# EasyEDA schematic SCH_RemoteRFController_2024-03-30.json
TITLE: Remote RF controller; REV: 1.0; Date: 2024-03-27; Sheet: 1/1; Company: KMK
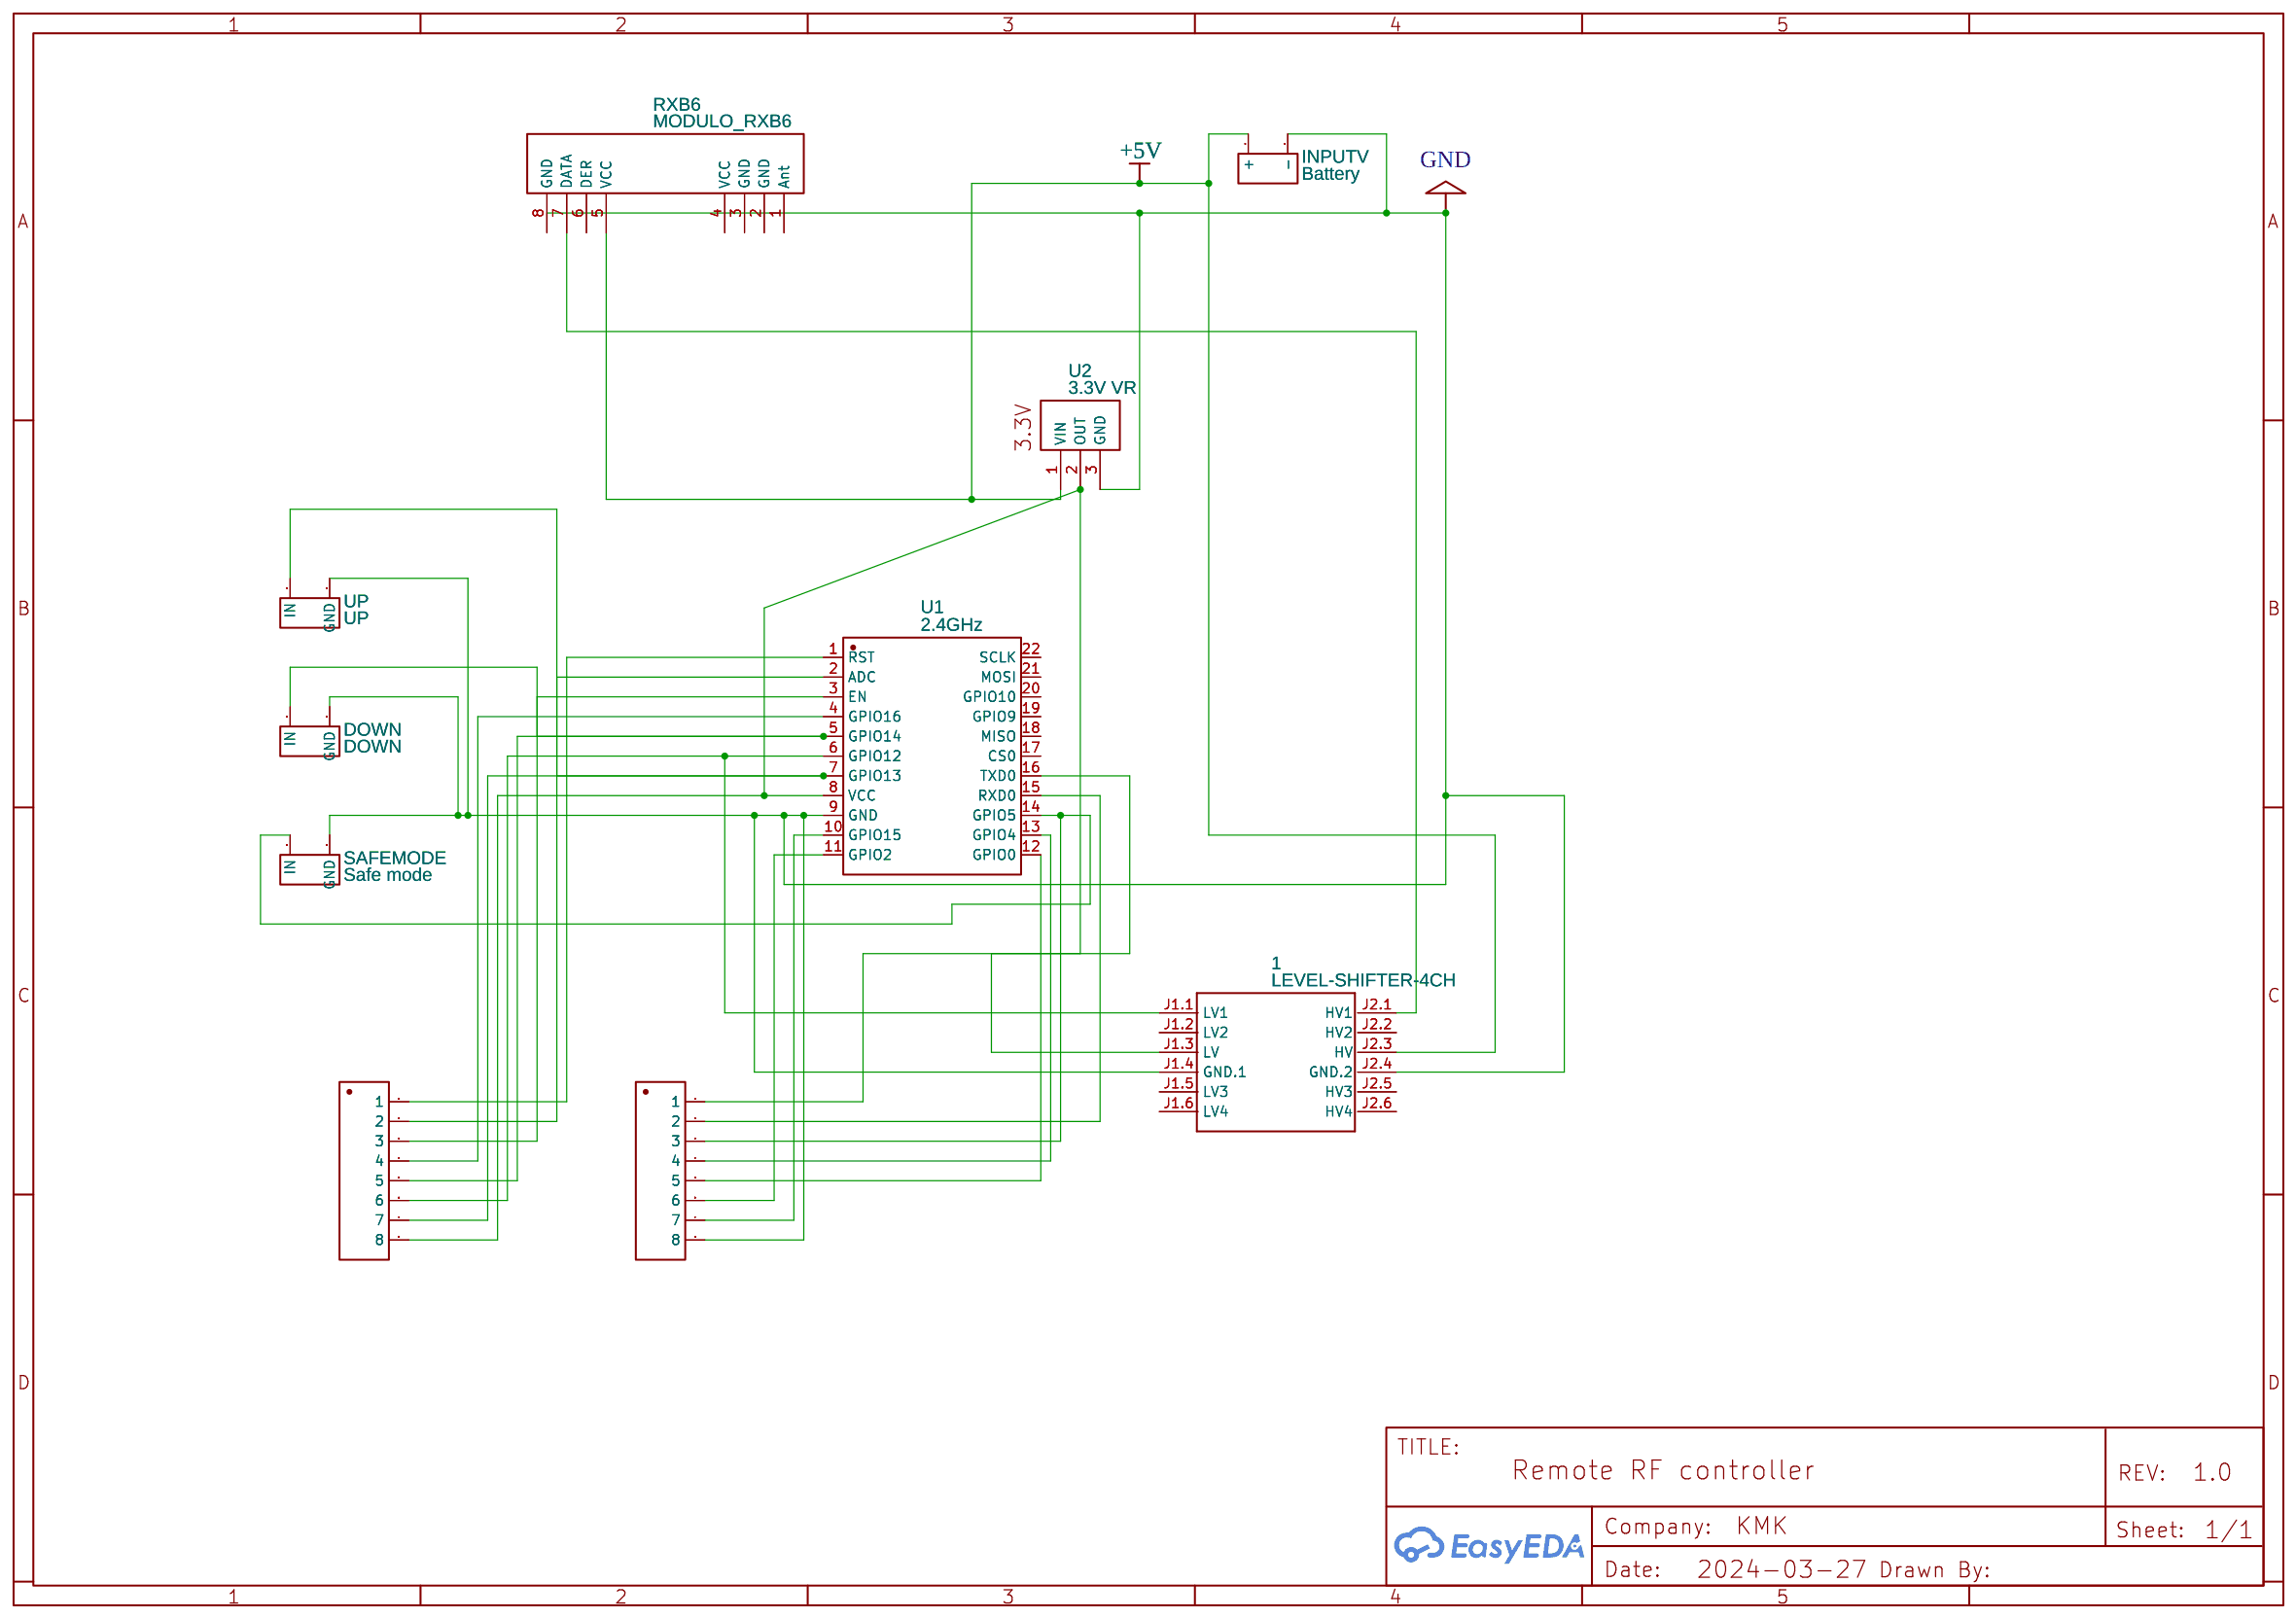
[diagram p0: schematic sheet]

## Parts
1  LEVEL-SHIFTER-4CH  [LEVEL-SHIFTER-4CH]
DOWN  DOWN  [CONNECTOR_PINHEADER_2.54MM:PINHEADER_1X11_P_2.54MM]
INPUTV  Battery  [CONNECTOR_PINHEADER_2.54MM:PINHEADER_1X11_P_2.54MM]
RXB6  MODULO_RXB6  [MODULO_RXB6]
SAFEMODE  Safe mode  [CONNECTOR_PINHEADER_2.54MM:PINHEADER_1X11_P_2.54MM]
ST7C1  HEADER 1X8 Socket  [HEADER - HEADER-FEMALE-2.54_1X8 ANGELO]
ST7C2  HEADER 1X8 Socket  [HEADER - HEADER-FEMALE-2.54_1X8 ANGELO]
U1  2.4GHz  [WIFIM-SMD_ESP-12F-ESP8266MOD]
U2  3.3V VR  [3.3V VOLTAGE REGULATOR]
UP  UP  [CONNECTOR_PINHEADER_2.54MM:PINHEADER_1X11_P_2.54MM]

## Library data of the parts
1 = LEVEL-SHIFTER-4CH: Contributor: mtomt
DOWN INPUTV SAFEMODE UP = HEADER PAD 2X: Manufacturer: BOOMELE; Manufacturer Part: Female headerHDR1X8-2.54; Supplier Part: C27438; JLCPCB Part Class: Extended Part; Contributor: papisdieng22
RXB6 = MODULO_RXB6: Manufacturer Part: RXB6-315; Contributor: bryanst11
ST7C1 ST7C2 = HEADER 1X8 COPY: Contributor: rprimmett
U1 = ESP-12F(ESP8266MOD): Supplier: LCSC; Manufacturer: Ai-Thinker(安信可); Supplier Part: C82891
U2 = 3.3V VR: Contributor: winter2015; sourceId: YsmgyP7pj

## Nets
+5V: 1.J2.3(HV) INPUTV.2(+) RXB6.5(VCC) U2.1(VIN)
GND: 1.J1.4(GND.1) 1.J2.4(GND.2) DOWN.1(GND) INPUTV.1(-) RXB6.8(GND) SAFEMODE.1(GND) ST7C2.8 U1.9(GND) U2.3(GND) UP.1(GND)
Net-(1-J1.1): 1.J1.1(LV1) ST7C1.6 U1.6(GPIO12)
Net-(1-J1.3): 1.J1.3(LV) ST7C1.8 U1.8(VCC) U2.2(OUT)
Net-(1-J2.1): 1.J2.1(HV1) RXB6.7(DATA)
Net-(DOWN-2): DOWN.2(IN) ST7C1.5 U1.5(GPIO14)
Net-(SAFEMODE-2): SAFEMODE.2(IN) ST7C2.3 U1.14(GPIO5)
Net-(ST7C1-1): ST7C1.1 U1.1(RST)
Net-(ST7C1-2): ST7C1.2 U1.2(ADC)
Net-(ST7C1-3): ST7C1.3 U1.3(EN)
Net-(ST7C1-4): ST7C1.4 U1.4(GPIO16)
Net-(ST7C1-7): ST7C1.7 U1.7(GPIO13) UP.2(IN)
Net-(ST7C2-1): ST7C2.1 U1.16(TXD0)
Net-(ST7C2-2): ST7C2.2 U1.15(RXD0)
Net-(ST7C2-4): ST7C2.4 U1.13(GPIO4)
Net-(ST7C2-5): ST7C2.5 U1.12(GPIO0)
Net-(ST7C2-6): ST7C2.6 U1.11(GPIO2)
Net-(ST7C2-7): ST7C2.7 U1.10(GPIO15)

Not connected (* = marked no-connect by the designer): 1 J1.2(LV2) J1.5(LV3) J1.6(LV4) J2.2(HV2) J2.5(HV3) J2.6(HV4); RXB6 1(Ant) 2(GND) 3(GND) 4(VCC) 6(DER); U1 17(CS0) 18(MISO) 19(GPIO9) 20(GPIO10) 21(MOSI) 22(SCLK)
